# EAGLE design team13_4 (EAGLE 8.6.3)
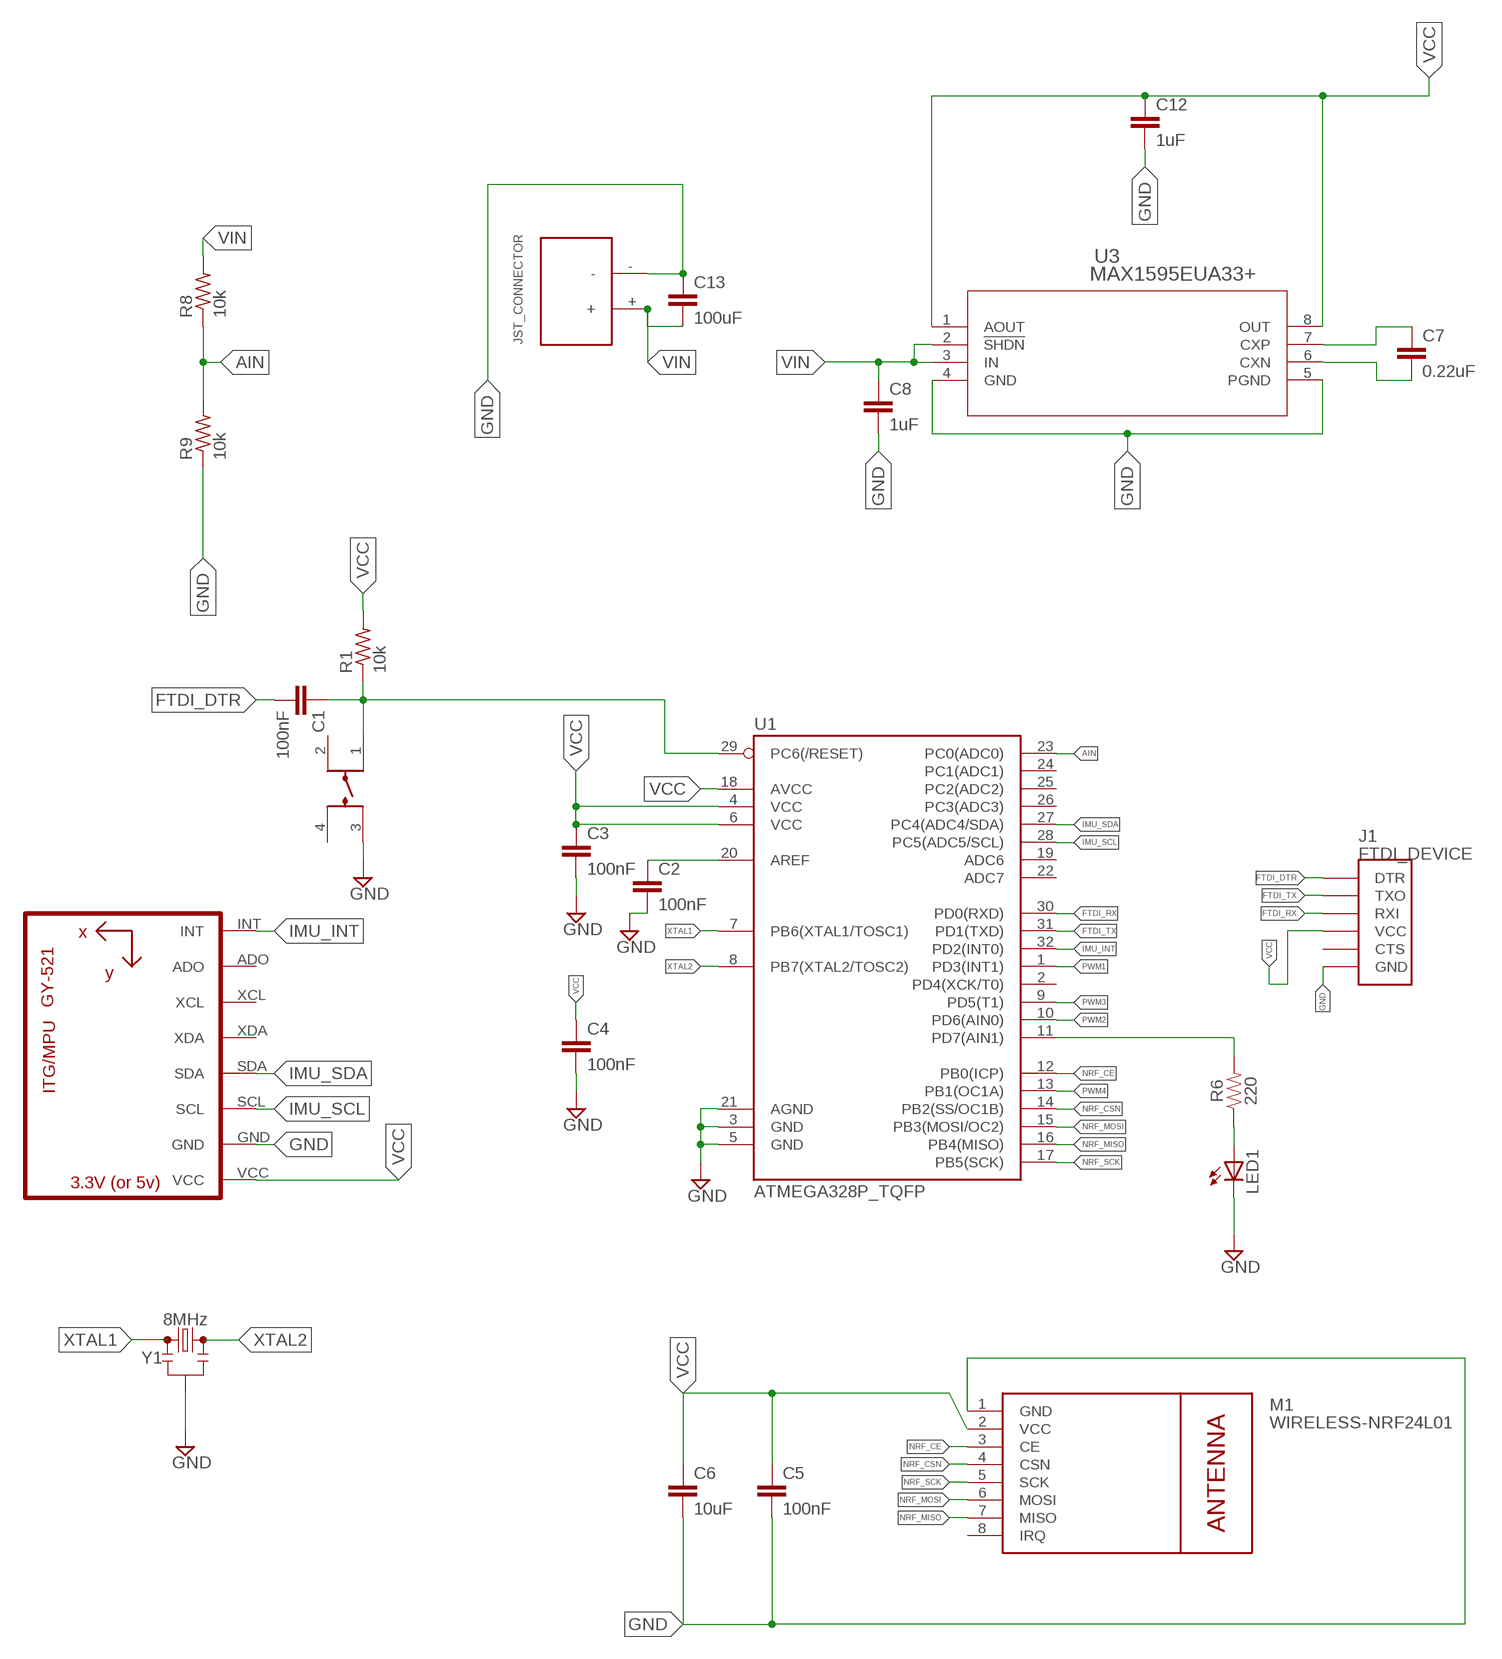
[diagram p0: schematic, sheet 1, part 1 of 3]
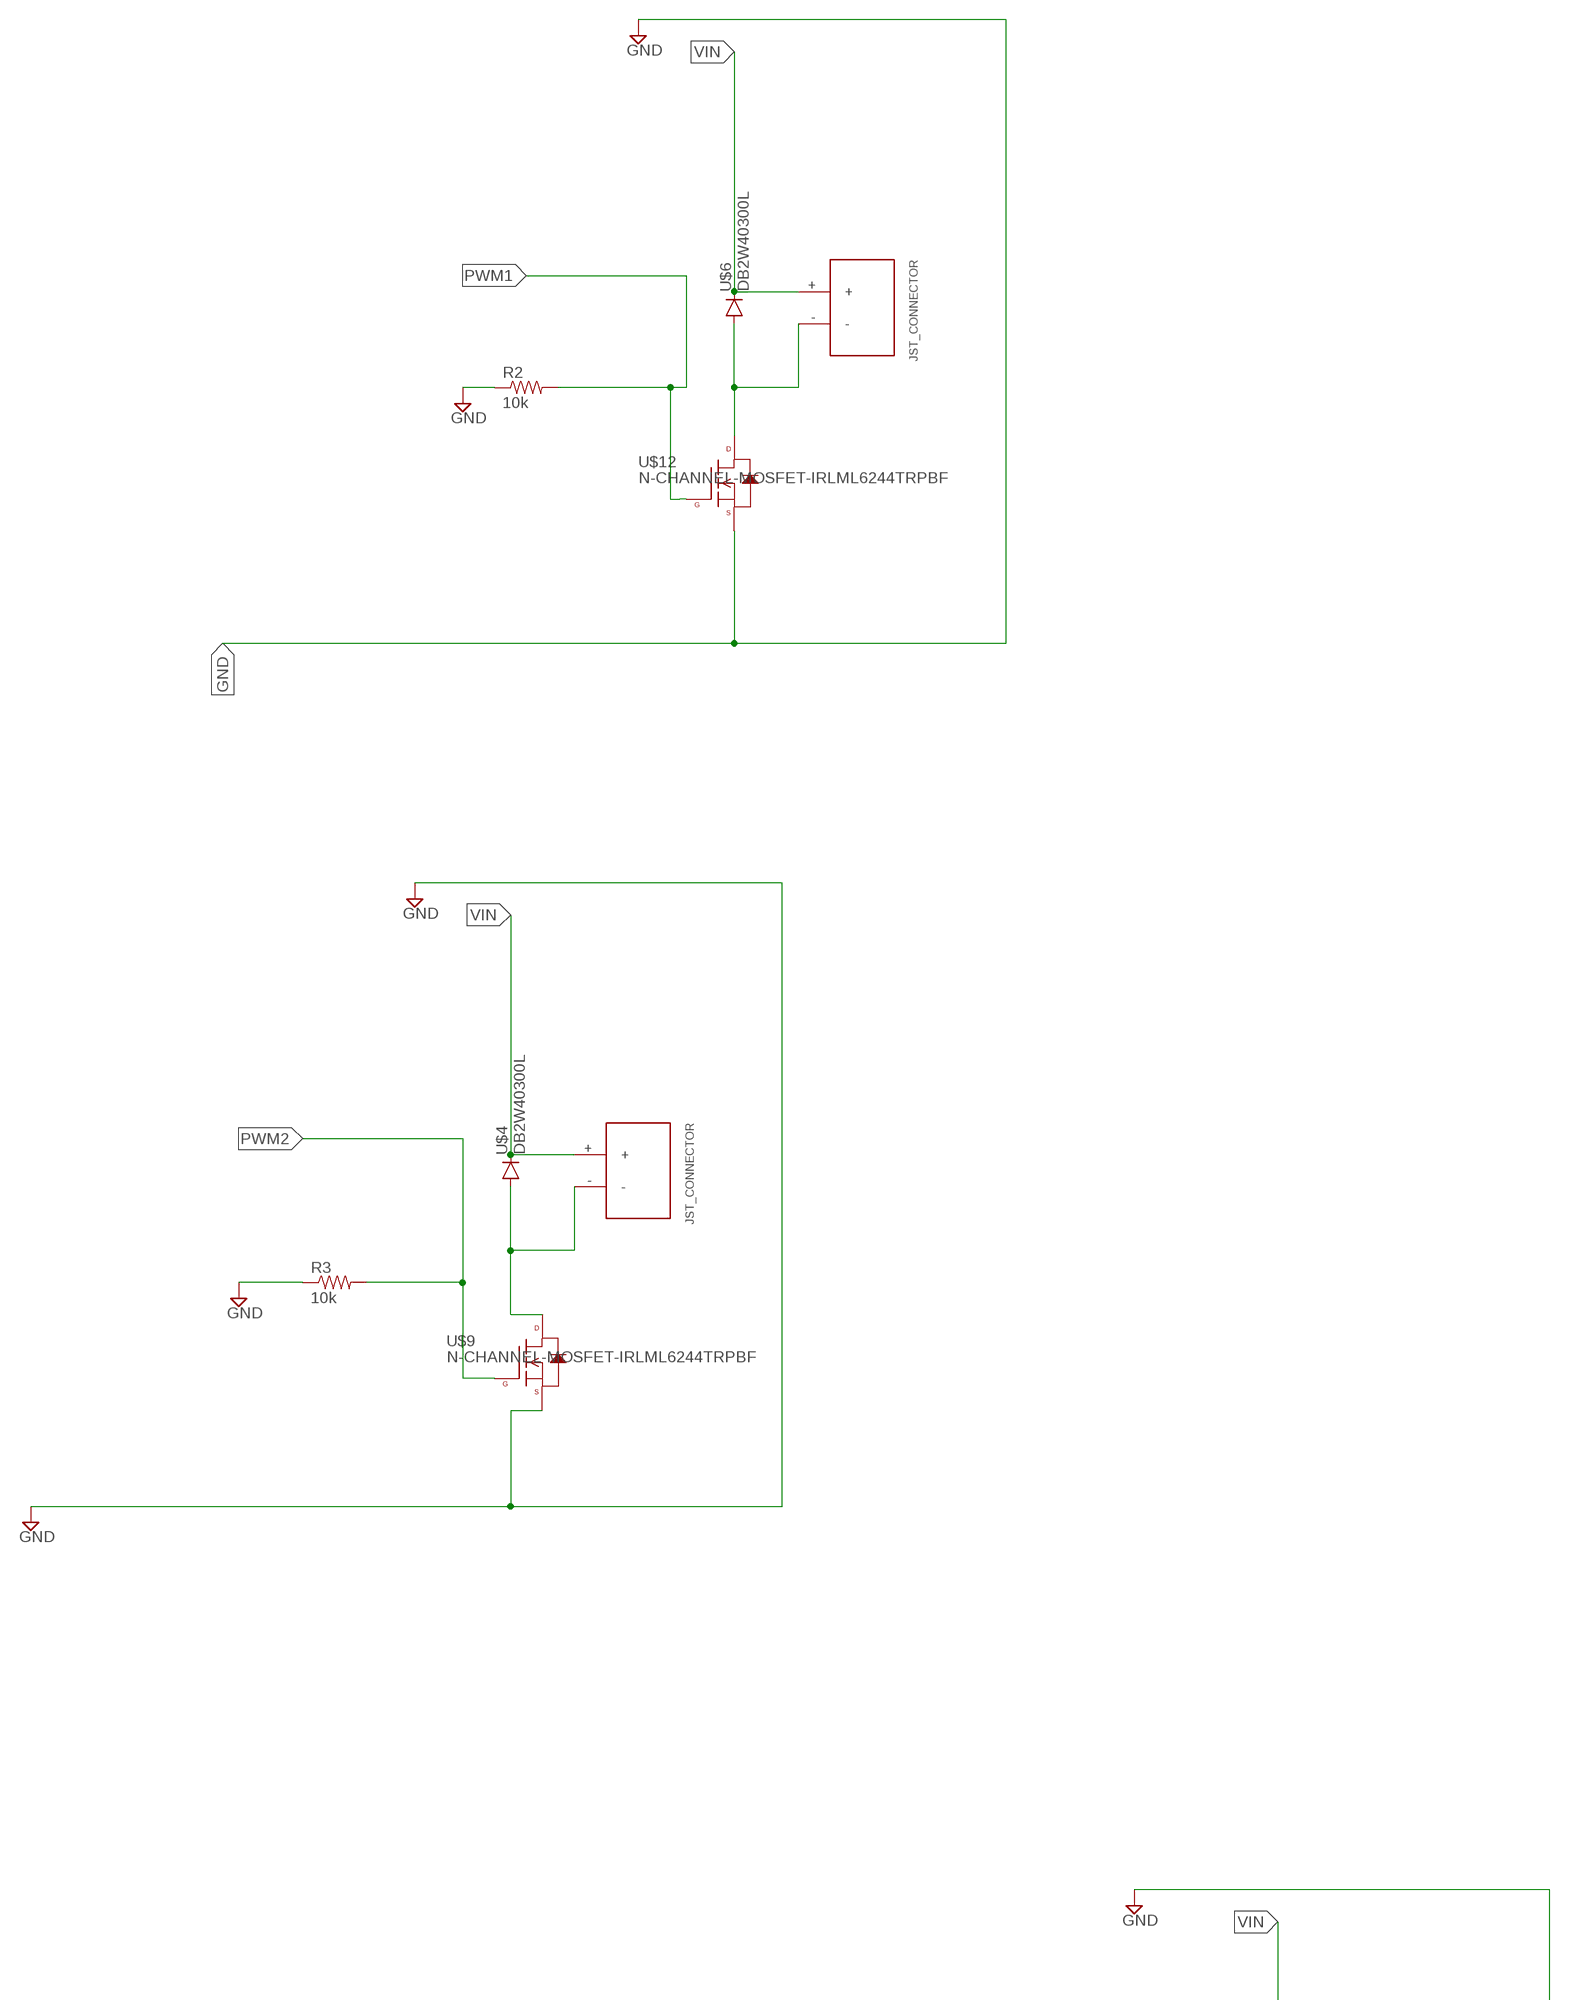
[diagram p1: schematic, sheet 1, part 2 of 3]
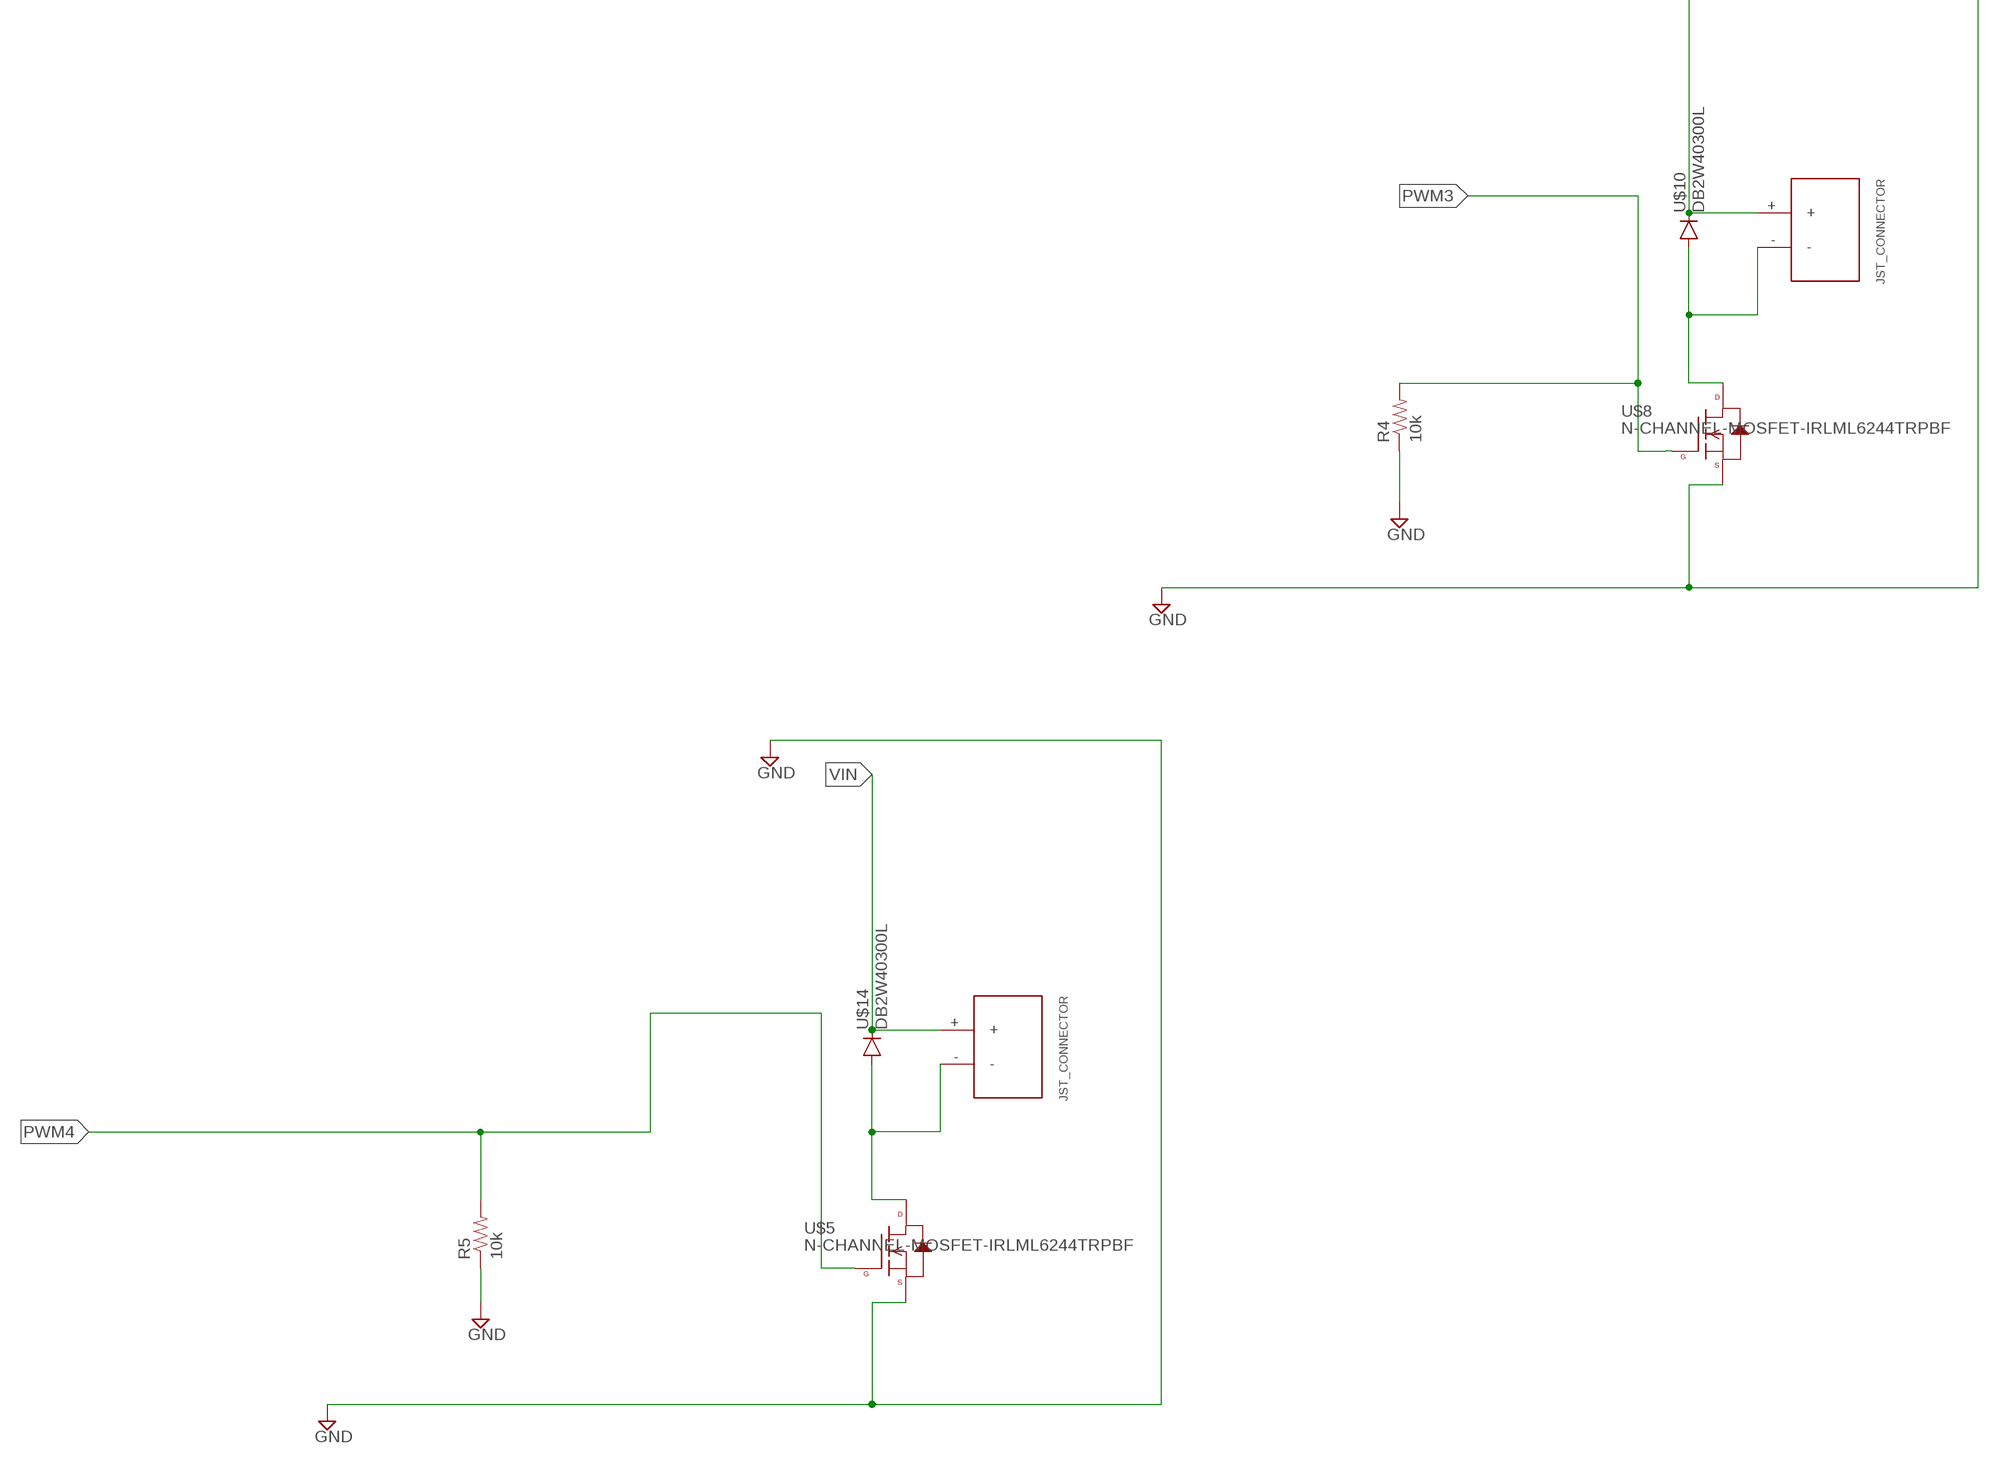
[diagram p2: schematic, sheet 1, part 3 of 3]

## Parts
C1  100nF  C-EUC0603  [C0603]
C2  100nF  C-EUC0603  [C0603]
C3  100nF  C-EUC0603  [C0603]
C4  100nF  C-EUC0603  [C0603]
C5  100nF  C-EUC0603  [C0603]
C6  10uF  C-EUC0603  [C0603]
C7  0.22uF  C-EUC0603  [C0603]
C8  1uF  C-EUC0805  [C0805]
C12  1uF  C-EUC0805  [C0805]
C13  100uF  C-EUC1210  [C1210]
J1  FTDI_DEVICE  [FTDI_DEVICE_SIDE]
LED1  LED1206  [LED-1206]
M1  WIRELESS-NRF24L01  [WIRELESS-NRF24L01]
R1  10k  R-US_R0603  [R0603]
R2  10k  RESISTOR0603  [0603-RES]
R3  10k  RESISTOR0603  [0603-RES]
R4  10k  RESISTOR0603  [0603-RES]
R5  10k  RESISTOR0603  [0603-RES]
R6  220  220OHM-0603-1/10W-1%  [0603]
R8  10k  R-US_R0603  [R0603]
R9  10k  R-US_R0603  [R0603]
U1  ATMEGA328P_TQFP  [TQFP32-08]
U2  GY-521MPU6050  [GY-521]
U3  MAX1595EUA33+  [21-0036K]
U$1  LL3301NF065QG  [LL3301NF065QG]
U$3  JST_CONNECTOR_FEMALE  [JST_CONNECTOR_FEMALE]
U$4  DB2W40300L  [MINI2-F3-B]
U$5  N-CHANNEL-MOSFET-IRLML6244TRPBF  [SOT23-3]
U$6  DB2W40300L  [MINI2-F3-B]
U$7  JST_CONNECTOR_FEMALE  [JST_CONNECTOR_FEMALE]
U$8  N-CHANNEL-MOSFET-IRLML6244TRPBF  [SOT23-3]
U$9  N-CHANNEL-MOSFET-IRLML6244TRPBF  [SOT23-3]
U$10  DB2W40300L  [MINI2-F3-B]
U$11  JST_CONNECTOR_FEMALE  [JST_CONNECTOR_FEMALE]
U$12  N-CHANNEL-MOSFET-IRLML6244TRPBF  [SOT23-3]
U$14  DB2W40300L  [MINI2-F3-B]
U$15  JST_CONNECTOR_FEMALE  [JST_CONNECTOR_FEMALE]
U$19  JST_CONNECTOR_FEMALE  [JST_CONNECTOR_FEMALE]
Y1  8MHz  RESONATOR-8MHZSMD_3.2X1.3  [RESONATOR-SMD-3.2X1.3]

## Nets
AIN: R8.1 R9.2 U1.23(PC0(ADC0))
FTDI_DTR: C1.2 J1.P$1(DTR)
FTDI_RX: J1.P$3(RXI) U1.30(PD0(RXD))
FTDI_TX: J1.P$2(TXO) U1.31(PD1(TXD))
GND: C2.2 C3.2 C4.2 C5.2 C6.2 C8.2 C12.2 C13.1 J1.P$6(GND) LED1.C M1.1(GND) R2.1 R3.1 R4.1 R5.1 R9.1 U1.3(GND) U1.5(GND) U1.21(AGND) U2.GND U3.4(GND) U3.5(PGND) U$1.3 U$5.2(S) U$8.2(S) U$9.2(S) U$12.2(S) U$19.- Y1.2
IMU_INT: U1.32(PD2(INT0)) U2.INT
IMU_SCL: U1.28(PC5(ADC5/SCL)) U2.SCL
IMU_SDA: U1.27(PC4(ADC4/SDA)) U2.SDA
N$1: C1.1 R1.1 U1.29(PC6(/RESET)) U$1.1
N$2: C2.1 U1.20(AREF)
N$5: U$3.- U$4.POS(PPIN) U$9.3(D)
N$6: C7.1 U3.7(CXP)
N$7: R6.2 U1.11(PD7(AIN1))
N$9: U$6.POS(PPIN) U$7.- U$12.3(D)
N$10: C7.2 U3.6(CXN)
N$11: LED1.A R6.1
N$13: U$8.3(D) U$10.POS(PPIN) U$11.-
N$17: U$5.3(D) U$14.POS(PPIN) U$15.-
NRF_CE: M1.3(CE) U1.12(PB0(ICP))
NRF_CSN: M1.4(CSN) U1.14(PB2(SS/OC1B))
NRF_MISO: M1.7(MISO) U1.16(PB4(MISO))
NRF_MOSI: M1.6(MOSI) U1.15(PB3(MOSI/OC2))
NRF_SCK: M1.5(SCK) U1.17(PB5(SCK))
PWM1: R2.2 U1.1(PD3(INT1)) U$12.1(G)
PWM2: R3.2 U1.10(PD6(AIN0)) U$9.1(G)
PWM3: R4.2 U1.9(PD5(T1)) U$8.1(G)
PWM4: R5.2 U1.13(PB1(OC1A)) U$5.1(G)
VCC: C3.1 C4.1 C5.1 C6.1 C12.1 J1.P$4(VCC) M1.2(VCC) R1.2 U1.4(VCC) U1.6(VCC) U1.18(AVCC) U2.VCC U3.1(AOUT) U3.8(OUT)
VIN: C8.1 C13.2 R8.2 U3.2(!SHDN) U3.3(IN) U$3.+ U$4.NEG(GPIN) U$6.NEG(GPIN) U$7.+ U$10.NEG(GPIN) U$11.+ U$14.NEG(GPIN) U$15.+ U$19.+
XTAL1: U1.7(PB6(XTAL1/TOSC1)) Y1.1
XTAL2: U1.8(PB7(XTAL2/TOSC2)) Y1.3
Unconnected: J1.P$5(CTS) M1.8(IRQ) U1.2(PD4(XCK/T0)) U1.19(ADC6) U1.22(ADC7) U1.24(PC1(ADC1)) U1.25(PC2(ADC2)) U1.26(PC3(ADC3)) U2.ADO U2.XCL U2.XDA U$1.2 U$1.4

## Library data of the parts
C1-C8 C12 C13 = rcl:C-EU: CAPACITOR, European symbol; SPICEPREFIX: C
J1 = quad:FTDI_DEVICE: Connector which mates to FTDI basic or FTDI cable.
LED1 = LilyPad-Wearables:LED: LEDs Standard schematic elements and footprints for 5mm, 3mm, 1206, and 0603 sized LEDs. 5mm - Spark Fun Electronics SKU : Comp-SBL
M1 = quad:WIRELESS-NRF24L01: 2.4 GHz Wireless Module based on NRF24L01 chip
R1 R8 R9 = rcl:R-US_: RESISTOR, American symbol; SPICEPREFIX: R
R2-R5 = SparkFun-Resistors:RESISTOR: Resistor Basic schematic elements and footprints for 0603, 1206, and PTH resistors.
R6 = SparkFun-Resistors:220OHM: 220Ω resistor A resistor is a passive two-terminal electrical component that implements electrical resistance as a circuit element. Resistors act to reduce current flow, and, at the same time, act to lower voltage levels within circuits. - Wikipedia; PROD_ID: RES-07861
U1 = quad:ATMEGA328P_TQFP; PROD_ID: IC-09069
U2 = quad:GY-521
U3 = MAX1595EUA33+:MAX1595EUA33+; MANUFACTURER_PART_NUMBER: MAX1595EUA33+; VENDOR: Maxim Integrated Products
U$1 = E-Switch:LL3301NF065QG
U$3 U$7 U$11 U$15 U$19 = quad:JST_CONNECTOR_FEMALE
U$4 U$6 U$10 U$14 = quad:DB2W40300L
U$5 U$8 U$9 U$12 = quad:N-CHANNEL-MOSFET: N-Channel MOSFET Mode Field Effect Transistor; DATASHEET: http://www.mouser.com/ds/2/196/irlml6244pbf-936666.pdf; MOUSER: 942-IRLML6244TRPBF; URL: http://www.mouser.com/Search/ProductDetail.aspx?R=IRLML6244TRPBFvirtualkey57370000virtualkey942-IRLML6244TRPBF
Y1 = SparkFun-Clocks:RESONATOR-8MHZ: 8MHz Resonator Digikey Example <http://www.digikey.com/product-detail/en/murata-electronics-north-america/CSTCE10M0G55-R0/490-1196-1-ND/584633> Frequency: 8MHz Frequency Stability: ±0.2% Frequency Tolerance: ±0.5% Capacitance: 33pF SparkFun Products Arduino Pro Mini 328- 3.3V/8MHz <https://www.sparkfun.com/products/11114> SparkFun Digital Sandbox <https://www.sparkfun.com/products/12651>; PROD_ID: XTAL-08895

## Board
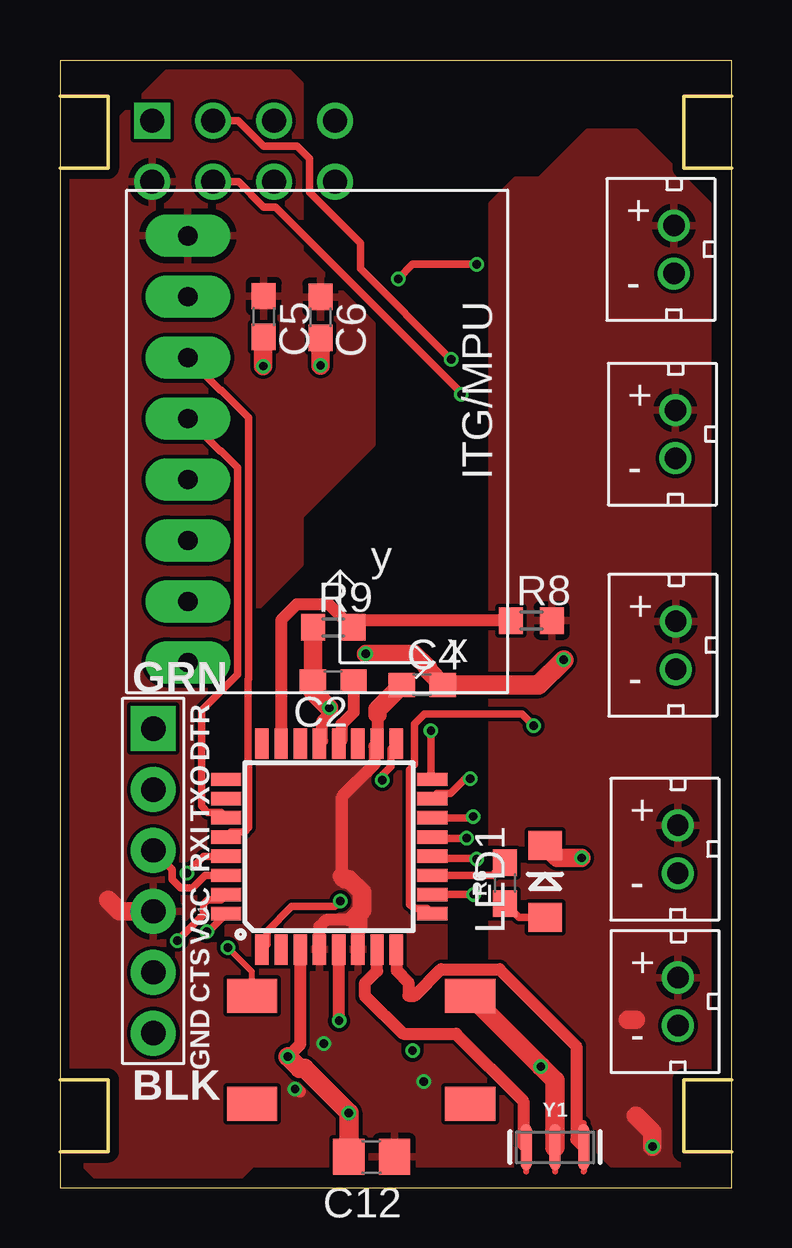
[diagram p3: board, top side]
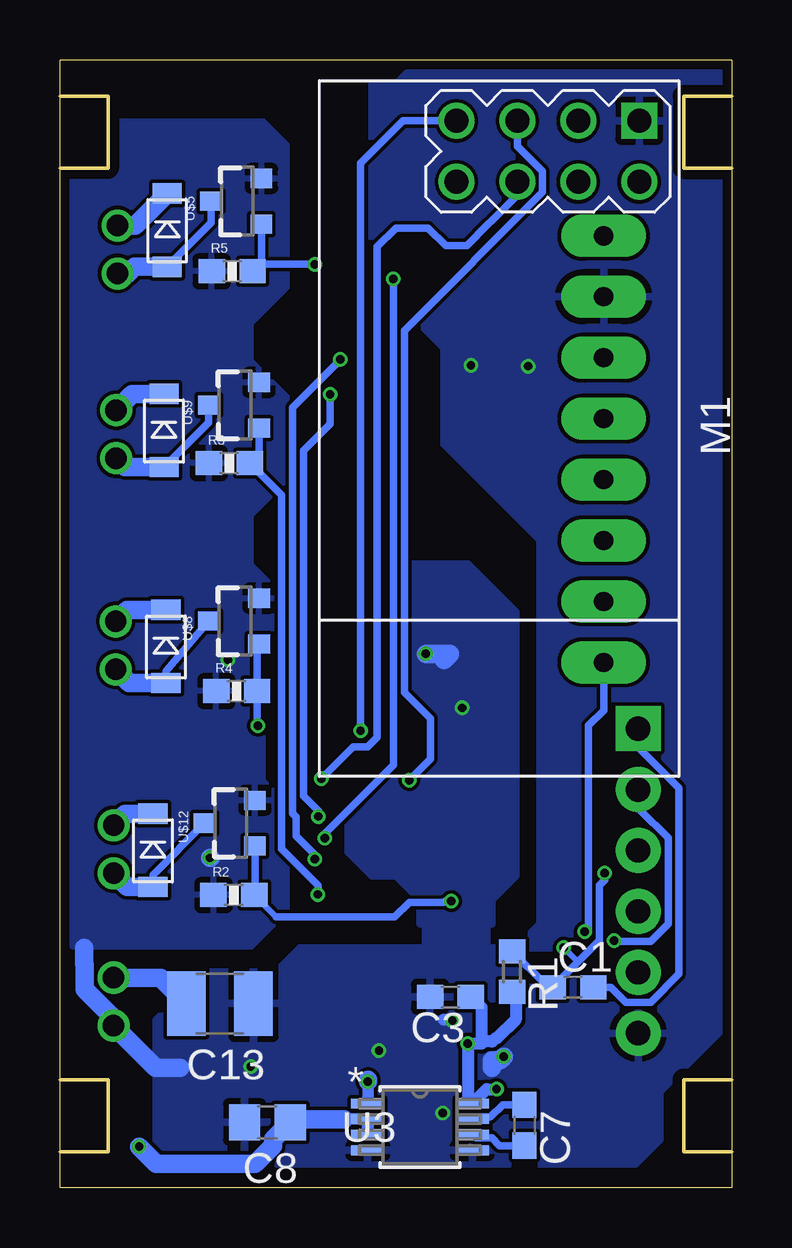
[diagram p4: board, bottom side, seen from below]

Size 28 x 47 mm. Coordinates in mm from the lower left corner, seen from the top.
Outline: 28,1.5 28,0 0,0 0,1.5
Outline: 28,1.5 28,4.5
Outline: 28,4.5 28,42.5
Outline: 28,42.5 28,45.5
Outline: 28,45.5 28,47 0,47 0,45.5
Outline: 0,45.5 0,42.5
Outline: 0,42.5 0,4.5
Outline: 0,4.5 0,1.5
Outline: 28,45.5 26,45.5 26,42.5 28,42.5
Outline: 28,1.5 26,1.5 26,4.5 28,4.5
Outline: 0,1.5 2,1.5 2,4.5 0,4.5
Outline: 0,45.5 2,45.5 2,42.5 0,42.5
Copper layers (1*16): Top 0.035559375mm / dielectric 1.6mm / Bottom 0.035559375mm
Design rules "oshpark-2layer-1": minimum track width 6mil, minimum drill 10mil, track to track 6mil, track to pad 6mil, pad to pad 6mil, via to via 6mil, smd to smd 6mil, copper to edge 15mil, drill to drill 6mil, minimum pad ring 5mil, minimum via ring 5mil, stop-mask expansion 2.5mil, vias tented up to drill 0mil, thermal gap 10mil

### Footprints (pad centres in the part's own frame; a part is rotated, then mirrored left to right if it is on the bottom)
C0603 = smd 1.1 x 1: 1 -0.85,0; 2 0.85,0
C0805 = smd 1.3 x 1.5: 1 -0.95,0; 2 0.95,0
C1210 = smd 1.6 x 2.7: 1 -1.4,0; 2 1.4,0
FTDI_DEVICE_SIDE = drill 1.016 pad 1.88 square: P$1 -6.35,0 | drill 1.016 pad 1.88: P$2 -3.81,0; P$3 -1.27,0; P$4 1.27,0; P$5 3.81,0; P$6 6.35,0
LED-1206 = smd 1.2 x 1.4: A -1.5,0; C 1.5,0
WIRELESS-NRF24L01 = drill 1 square: 1 -12.7,6.35 | drill 1: 2 -10.16,6.35; 3 -12.7,3.81; 4 -10.16,3.81; 5 -12.7,1.27; 6 -10.16,1.27; 7 -12.7,-1.27; 8 -10.16,-1.27
R0603 = smd 1 x 1.1: 1 -0.85,0; 2 0.85,0
0603-RES = smd 1.1 x 1: 1 -0.85,0; 2 0.85,0
0603 = smd 1.1 x 1: 1 -0.85,0; 2 0.85,0
TQFP32-08 = smd 1.27 x 0.559: 1 -4.293,2.8; 2 -4.293,2; 3 -4.293,1.2; 4 -4.293,0.4; 5 -4.293,-0.4; 6 -4.293,-1.2; 7 -4.293,-2; 8 -4.293,-2.8; 17 4.293,-2.8; 18 4.293,-2; 19 4.293,-1.2; 20 4.293,-0.4; 21 4.293,0.4; 22 4.293,1.2; 23 4.293,2; 24 4.293,2.8 | smd 0.559 x 1.27: 9 -2.8,-4.293; 10 -2,-4.293; 11 -1.2,-4.293; 12 -0.4,-4.293; 13 0.4,-4.293; 14 1.2,-4.293; 15 2,-4.293; 16 2.8,-4.293; 25 2.8,4.293; 26 2,4.293; 27 1.2,4.293; 28 0.4,4.293; 29 -0.4,4.293; 30 -1.2,4.293; 31 -2,4.293; 32 -2.8,4.293
GY-521 = drill 0.8 pad 1.778 long: ADO -8.89,-6.35; GND -8.89,6.35; INT -8.89,-8.89; SCL -8.89,3.81; SDA -8.89,1.27; VCC -8.89,8.89; XCL -8.89,-3.81; XDA -8.89,-1.27
21-0036K = smd 1.372 x 0.406: 1 -2.184,0.975; 2 -2.184,0.325; 3 -2.184,-0.325; 4 -2.184,-0.975; 5 2.184,-0.975; 6 2.184,-0.325; 7 2.184,0.325; 8 2.184,0.975
LL3301NF065QG = smd 2.1 x 1.4: 1 0,0; 2 0,-4.5; 3 9.1,0; 4 9.1,-4.5
JST_CONNECTOR_FEMALE = drill 0.889: + 0,1; - 0,-1
MINI2-F3-B = smd 1.22 x 0.85: NEG 0,1.55; POS 0,-1.5
SOT23-3 = smd 0.8 x 0.9: 1 -0.95,-1; 2 0.95,-1; 3 0,1.1
RESONATOR-SMD-3.2X1.3 = smd 0.45 x 1.905: 1 -1.2,0; 2 0,0; 3 1.2,0

### Placement (x,y rotation side)
C1  6.61,8.35 0 bottom
C2  11.39,21.1 180 top
C3  11.72,7.95 180 bottom
C4  15.1,20.95 0 top
C5  8.5,36.31 270 top
C6  10.86,36.27 270 top
C7  8.63,2.6 270 bottom
C8  19.35,2.72 180 bottom
C12  12.99,1.28 180 top
C13  21.33,7.67 180 bottom
J1  3.89,12.78 270 top
LED1  20.23,12.76 90 top
M1  10.2,31.76 270 bottom
R1  9.15,9 270 bottom
R2  20.75,12.19 0 bottom
R3  20.94,30.19 0 bottom
R4  20.63,20.69 0 bottom
R5  20.82,38.19 0 bottom
R6  18.56,12.69 90 top
R8  19.66,23.63 0 top
R9  11.39,23.35 0 top
U1  11.22,14.21 90 top
U2  14.22,30.78 0 top
U3  12.99,2.53 0 bottom
U$1  8.01,7.99 0 top
U$3  25.66,31.4 0 top
U$4  23.66,31.53 0 bottom
U$5  20.6,41.11 90 bottom
U$6  24.12,14.03 0 bottom
U$7  25.76,14.1 0 top
U$8  20.7,23.61 90 bottom
U$9  20.7,32.61 90 bottom
U$10  23.58,22.53 0 bottom
U$11  25.68,22.6 0 top
U$12  20.87,15.19 90 bottom
U$14  23.53,39.88 0 bottom
U$15  25.6,39.1 0 top
U$19  25.77,7.75 0 top
Y1  20.64,1.68 0 top

### Tracks (layer width: path | path; a pad name or v marks a point on that pad's centre or on a via)
AIN
  Top 0.508: R8.1 12.52,23.63 R9.2 12.17,23.35 11.21,24.31 9.88,24.31 9.22,23.65 U1.23
FTDI_DTR
  Bottom 0.305: C1.2 5.03,8.35 4.41,7.72 3.37,7.72 2.19,8.91 2.19,16.65 3.89,18.35 J1.P$1
FTDI_RX
  Top 0.305: J1.P$3 4.68,13.26 4.68,12.85 5.04,12.49 5.54,12.49 6.05,13.01 U1.30
FTDI_TX  (via drill 0.35)
  Top 0.305: U1.31 6.71,11.99 6.17,11.99 5.99,11.82 5.99,11.39 v4.9,10.3
  Bottom 0.305: J1.P$2 3.82,16.59 3.82,15.74 2.65,14.57 2.65,10.99 3.37,10.27 4.87,10.27 v4.9,10.3
GND  (via drill 0.35)
  Top 0.508: U1.21 10.93,18.62 10.93,19.44 11.23,19.73 v11.23,19.99 | U1.5 11.62,6.97 v11.64,6.95 | 10,9.9 U1.3 10.02,5.97 v9.5,5.45
  Top 0.762: v11.23,19.99 10.54,20.68 C2.2 R9.1 | LED1.C 20.75,13.74 v21.74,13.74 | C5.2 8.48,35.44 v8.48,34.24 | C6.2 10.86,34.27 v10.87,34.27 | C4.2 15.33,21.57 15.33,21.67 14.75,22.25 v12.75,22.25
  Top 0.813: v9.5,5.45 9.99,4.96 10.19,4.96 v12.04,3.11 C12.2 | Y1.2 20.64,4.46 v20.05,5.05 U$1.3 | C4.2 19.95,20.95 v21,22
  Bottom 0.508: v11.64,6.95 11.69,7 12,7
  Bottom 0.762: 21.72,13.74 v21.74,13.74 | 27,10 27,9.32 26.97,9.29 26.97,8.25 25.77,7.05 U$19.- 24.02,5 23,5 | v12.75,22.25 11.75,22.25 12,22 | 10,5 10,5.3 9.65,5.3 v9.5,5.45
  other vias: 14.7,5.7
  pour Bottom: 28,10.5 28,43.5 27,44.5 19.5,44.5 18.5,43.5 18.5,37.5 20,36 20,34.5 18.5,33 18.5,29.5 20,28 20,26 18.5,24.5 18.5,20 19.5,19 19.5,17 18.5,16 18.5,11.5 20,10 27.5,10
  pour Bottom: 10.31,12.14 10.31,9.91 12.65,9.91 12.65,12.14 12.62,12.17 10.31,12.17
  pour Bottom: 11,1 23,1 24,2 24,7 23,8 22,9 14,9 13,10 8,10 7,11 7,30 15,38 15,46 4,46 3,45 3,43 2,42 1,41 1,6 2,5 3,4 3,2 4,1
  pour Bottom: 13,10 18,10 19,9 14,9
  pour Bottom: 9,10 8,11 8,27 9,28 12,31 12,35 9,35 6,38 2,38 2,10
  pour Bottom: 10,25 11,26 15,26 16,25 16,14 15,13 14,13 13,12 13,11 10,11 10,12 9,13 9,24
  pour Bottom: 15,45 13,47 0,47 0,7 3,4 5,4 6,5 6,38 7,39 14,39 15,40
IMU_INT  (via drill 0.35)
  Top 0.305: 6.53,11.41 U1.32 6.18,10.66 v6.12,10.66
  Bottom 0.305: U2.INT 5.33,19.89 5.97,19.25 5.97,10.81 v6.12,10.66
IMU_SCL
  Top 0.305: U1.28 7.14,14.83 7.69,14.83 7.87,15 7.87,17.71 7.84,17.74 7.84,21.17 7.87,21.21 7.87,32.05 7.87,32.09 6.71,33.24 6.68,33.24 U2.SCL
IMU_SDA
  Top 0.305: U1.27 6.71,15.63 6.17,15.63 5.9,15.9 5.9,19.88 7.41,21.4 7.41,30 6.71,30.7 6.68,30.7 U2.SDA
N$1  (via drill 0.35)
  Top 0.254: U$1.1 8.01,8.99 v7,10
  Top 0.305: U1.29 6,13.81 v5.29,13.1
  Bottom 0.254: v7,10 6.41,9.4
  Bottom 0.305: v5.29,13.1 5.29,12.81 5.51,12.59 5.51,10.27 5.54,10.27 6.41,9.4 C1.1 7.46,8.51 7.81,8.51 R1.1
N$2
  Top 0.508: U1.20 11.73,18.62 11.73,19.31 12.24,19.81 C2.1
N$5
  Bottom 0.305: U$9.3 21.8,31.89 U$4.POS
  Bottom 0.762: U$4.POS 25.29,30.03 U$3.-
N$6
  Bottom 0.305: U3.7 10.71,2.95 10.04,2.95 9.54,3.45 C7.1
N$7
  Top 0.305: U1.11 18.03,13.01 R6.2
N$9
  Bottom 0.305: U$12.3 24.12,13.04 U$6.POS
  Bottom 0.762: U$6.POS 25.19,12.53 U$7.-
N$10
  Bottom 0.305: U3.6 10.66,2.06 9.99,2.06 9.68,1.75 C7.2
N$11
  Top 0.305: LED1.A 19.14,11.26 R6.1
N$13
  Bottom 0.305: U$8.3 23.58,21.53 U$10.POS
  Bottom 0.762: U$10.POS 25.11,21.03 U$11.-
N$17
  Bottom 0.305: U$5.3 21.7,40.21 U$14.POS
  Bottom 0.762: U$14.POS 24.88,38.38 25.16,38.1 U$15.-
NRF_CE  (via drill 0.35)
  Top 0.305: 16.31,34.54 v16.31,34.52 12.53,38.3 12.53,39.36 10.41,41.48 10.41,42.88 9.89,43.4 8.49,43.4 7.43,44.46 M1.3 | U1.12 15.61,13.72 17.35,13.72 v17.37,13.69
  Bottom 0.305: v16.31,34.52 18.31,32.52 18.31,15.59 18.16,15.44 18.16,14.66 17.37,13.87 v17.37,13.69
NRF_CSN  (via drill 0.35)
  Top 0.305: v16.74,33.07 16.76,33.1 8.99,40.87 8.49,40.87 7.44,41.92 M1.4 | v17.22,15.47 17.16,15.41 U1.14
  Bottom 0.305: v16.74,33.07 16.74,31.82 17.85,30.71 17.85,16.33 17.22,15.7 v17.22,15.47
NRF_MISO  (via drill 0.35)
  Top 0.305: v15.47,19.05 15.47,17.05 U1.16
  Bottom 0.305: 15.47,19 v15.47,19.05 15.47,42.7 13.71,44.46 M1.7
NRF_MOSI  (via drill 0.35)
  Top 0.305: U1.15 15.73,16.43 16.27,16.43 16.9,17.05 v17.1,17.05
  Bottom 0.305: v17.1,17.05 15.78,18.37 15.19,18.37 14.79,18.77 14.79,39.21 14,40 12.65,40 11.91,39.26 11.03,39.26 10.15,40.15 9.97,40.32 8.93,41.36 M1.6
NRF_SCK  (via drill 0.35)
  Top 0.305: U1.17 13.8,18.29 13.8,17.55 13.44,17.19 v13.44,16.98
  Bottom 0.305: M1.5 8.93,43.41 7.88,42.36 7.88,41.48 13.64,35.71 13.64,20.64 12.55,19.55 12.55,17.87 v13.44,16.98
PWM1  (via drill 0.35)
  Top 0.305: U1.1 8.64,10.13 8.64,10.68 9.67,11.71 11.46,11.71 v11.68,11.94
  Bottom 0.254: R2.2 18.99,11.28
  Bottom 0.305: U$12.1 19.87,12.22 R2.2 | 18.99,11.28 14.05,11.28 13.44,11.89 12.01,11.89 11.97,11.94 v11.68,11.94
PWM2  (via drill 0.35)
  Top 0.305: U1.10 v17.24,12.21 v17.25,12.22 17.27,12.24
  Bottom 0.305: U$9.1 19.7,30.58 R3.2 18.77,28.87 18.77,14.12 17.25,12.6 v17.25,12.22
PWM3  (via drill 0.35)
  Top 0.305: v19.75,19.25 19.26,19.74 15.19,19.74 14.79,19.33 14.79,17.63 14.57,17.42 14.57,11.8 14.75,11.63 15.3,11.63 U1.9
  Bottom 0.305: U$8.1 19.78,22.28 R4.2 | R4.2 19.78,20.52 19.8,20.5 | v19.75,19.25 19.78,19.28 R4.2
PWM4  (via drill 0.35)
  Top 0.305: U1.13 15.56,14.56 v16.95,14.56 | v14.1,37.87 14.71,38.48 v17.37,38.48 17.42,38.48
  Bottom 0.305: U$5.1 19.6,38.56 R5.2 19.68,38.48 v17.37,38.48 | v16.95,14.56 16.95,14.77 14.1,17.62 14.1,18 14.1,19 14.1,37.8 14.17,37.87 v14.1,37.87
VCC  (via drill 0.35)
  Top 0.508: U1.4 10.82,10.87 11.1,11.15 12.01,11.15 | 12.01,11.15 12.09,11.15 12.42,10.82 U1.6 | 13.23,19.71 13.23,18.52 U1.18 13.11,18.39 13.11,17.64 11.76,16.3 11.76,12.97 12.47,12.26 12.47,11.61 12.01,11.15 | v9.8,4.1 9.9,4.1 10,4
  Top 0.762: C4.1 13.23,19.93 13.23,19.71 | 12.42,10.82 12.42,11.38 12.6,11.56 12.6,12.31 12.06,12.85 11.88,12.85 11.76,12.97 | J1.P$4 2.49,11.51 2,12
  Bottom 0.483: v15.16,4.42 15.16,3.52 U3.1
  Bottom 0.508: 15.17,4.49 15.16,4.5 | v9.8,4.1 10.21,4.1 U3.8 11,3.7 v11,6 | R1.2 9,8 9,7 9.76,6.24 9.83,6.24 9.98,6.09 | 9.98,6.09 10,6.09 10.33,6.09 | 10.33,6.09 10.41,6 | 10.41,6 v11,6 | 9.98,6.09 10.33,6.09 | 10.33,6.09 10.41,6 | 10.41,6 v11,6 | 10.41,6 10.41,7.49 C3.1
  Bottom 0.762: 15.16,4.5 v15.16,4.42
  pour Top: 12,17 11,17 10,16 10,13 11,12 12,12 13,13 13,16
  pour Top: 1,41 3,43 3,44 5,46 6,46 10,42 10,26 6,22 6,11 8,9 17,9 18,8 18,7 21,4 21,2 20,1 4,1 3,2 3,5 1,7
  pour Top: 16,8 16,18 7,18 7,8
  pour Top: 0,2 2,0 7,0 9,2 10,3 10,10 5,15 5,22 6,23 10,27 10,45 10,46 9,47 5,47 0,42
  pour Top: 9,40 13,36 13,31 9,27
VIN  (via drill 0.35)
  Top 0.762: 25.65,23.63 U$11.+ | 23.68,7 24,7 | v24.7,1.7 24.7,2.3 24,3
  Bottom 0.483: 16.16,2.85 16.15,2.85 U3.2
  Bottom 0.508: U3.2 U3.3
  Bottom 0.762: U$4.NEG 24.98,33.08 U$3.+ | U$10.NEG 25.2,24.08 U$11.+ | U$6.NEG 25.28,15.58 U$7.+ | U$14.NEG 24.86,40.1 U$15.+ | C13.2 23.81,8.75 U$19.+ | 16.16,2.85 18.27,2.85 C8.1 19.12,2 19.12,1.75 19.87,1 24,1 v24.7,1.7
  pour Top: 21,43 22,44 24,44 25,43 27,41 27,7 25,5 22,5 21,6 20,7 18,9 18,41 19,42 20,42
  pour Top: 27,7 27,2 26,1 23,1 22,2 22,7
XTAL1
  Top 0.508: U1.7 13.22,9.03 12.73,8.54 12.73,8 | 12.73,7.97 12.73,8 | 12.73,8 14.32,6.41 16.52,6.41 19.32,3.61 19.32,1.8 Y1.1
XTAL2
  Top 0.508: 14.53,8 14.53,8.56 14.04,9.04 14.04,9.89 U1.8 | 14.53,8 14.53,7.99 | Y1.3 21.53,1.99 21.53,5.9 18.33,9.1 15.89,9.1 14.79,8 14.53,8